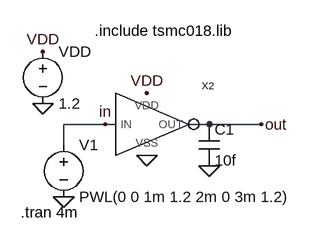
[diagram p0: schematic Draft1.asc]
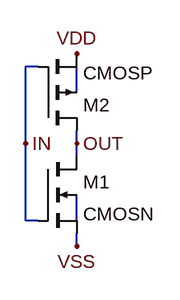
[diagram p1: sub-circuit inv_x1.asc]
Draft1.asc, the LTspice schematic file:
Version 4
SHEET 1 880 680
WIRE 112 160 48 160
WIRE 128 160 112 160
WIRE 272 160 240 160
WIRE 352 160 272 160
WIRE 48 192 48 160
FLAG 176 208 0
FLAG 48 272 0
FLAG 176 112 VDD
FLAG 16 128 0
FLAG 16 48 VDD
FLAG 112 160 in
FLAG 352 160 out
FLAG 272 224 0
SYMBOL voltage 48 176 R0
WINDOW 123 0 0 Left 0
WINDOW 39 0 0 Left 0
SYMATTR InstName V1
SYMATTR Value PWL(0 0 1m 1.2 2m 0 3m 1.2)
SYMBOL voltage 16 32 R0
SYMATTR InstName VDD
SYMATTR Value 1.2
SYMBOL inv_x1 176 160 R0
SYMATTR InstName X2
SYMBOL cap 256 160 R0
SYMATTR InstName C1
SYMATTR Value 10f
TEXT -18 296 Left 2 !.tran 4m
TEXT 96 16 Left 2 !.include tsmc018.lib

inv_x1.asc, the sub-circuit schematic file:
Version 4
SHEET 1 880 680
WIRE 160 48 144 48
WIRE 208 80 208 48
WIRE 144 144 144 48
WIRE 208 144 208 128
WIRE 208 160 208 144
WIRE 144 240 144 144
WIRE 160 240 144 240
WIRE 208 240 208 208
WIRE 208 272 208 256
FLAG 208 32 VDD
FLAG 208 272 VSS
FLAG 144 144 IN
FLAG 208 144 OUT
SYMBOL cmosn 160 160 R0
SYMATTR InstName M1
SYMATTR Value2 l=180nm w=1um
SYMBOL cmosp 160 128 M180
SYMATTR InstName M2
SYMATTR Value2 l=180nm w=5um

The netlist it stands for:
* Draft1.asc
V1 in 0 PWL(0 0 1m 1.2 2m 0 3m 1.2)
VDD VDD 0 1.2
XX2 in out VDD 0 inv_x1
C1 out 0 10f

* block symbol definitions
.subckt inv_x1 IN OUT VDD VSS
M1 OUT IN VSS N002 CMOSN l=180nm w=1um
M2 OUT IN VDD N001 CMOSP l=180nm w=5um
.ends inv_x1

.model NMOS NMOS
.model PMOS PMOS
.lib standard.mos
.tran 4m
.include tsmc018.lib
.backanno
.end